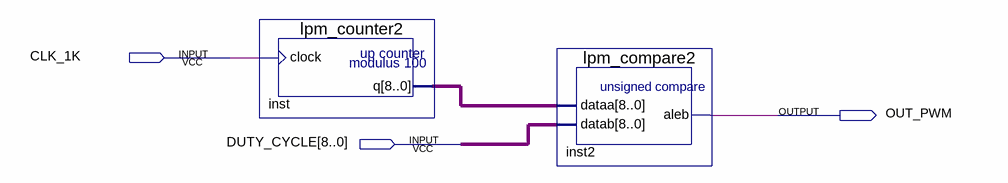
[diagram p0: schematic sheet]
// Quartus schematic pwm.bdf as structural Verilog: 2 symbols, 3 pins
module pwm (
  input  CLK_1K,
  input  [8:0] DUTY_CYCLE,
  output OUT_PWM
);

  wire [8:0] inst_q;

  lpm_counter2 inst (.clock(CLK_1K), .q(inst_q));
  lpm_compare2 inst2 (.dataa(inst_q), .datab(DUTY_CYCLE), .aleb(OUT_PWM));
endmodule
